# EasyEDA schematic TCRT5000-w-LDR.json
TITLE: Sheet_1; REV: 1.0; Date: 2024-02-27; Sheet: 1/1; Company: Your Company
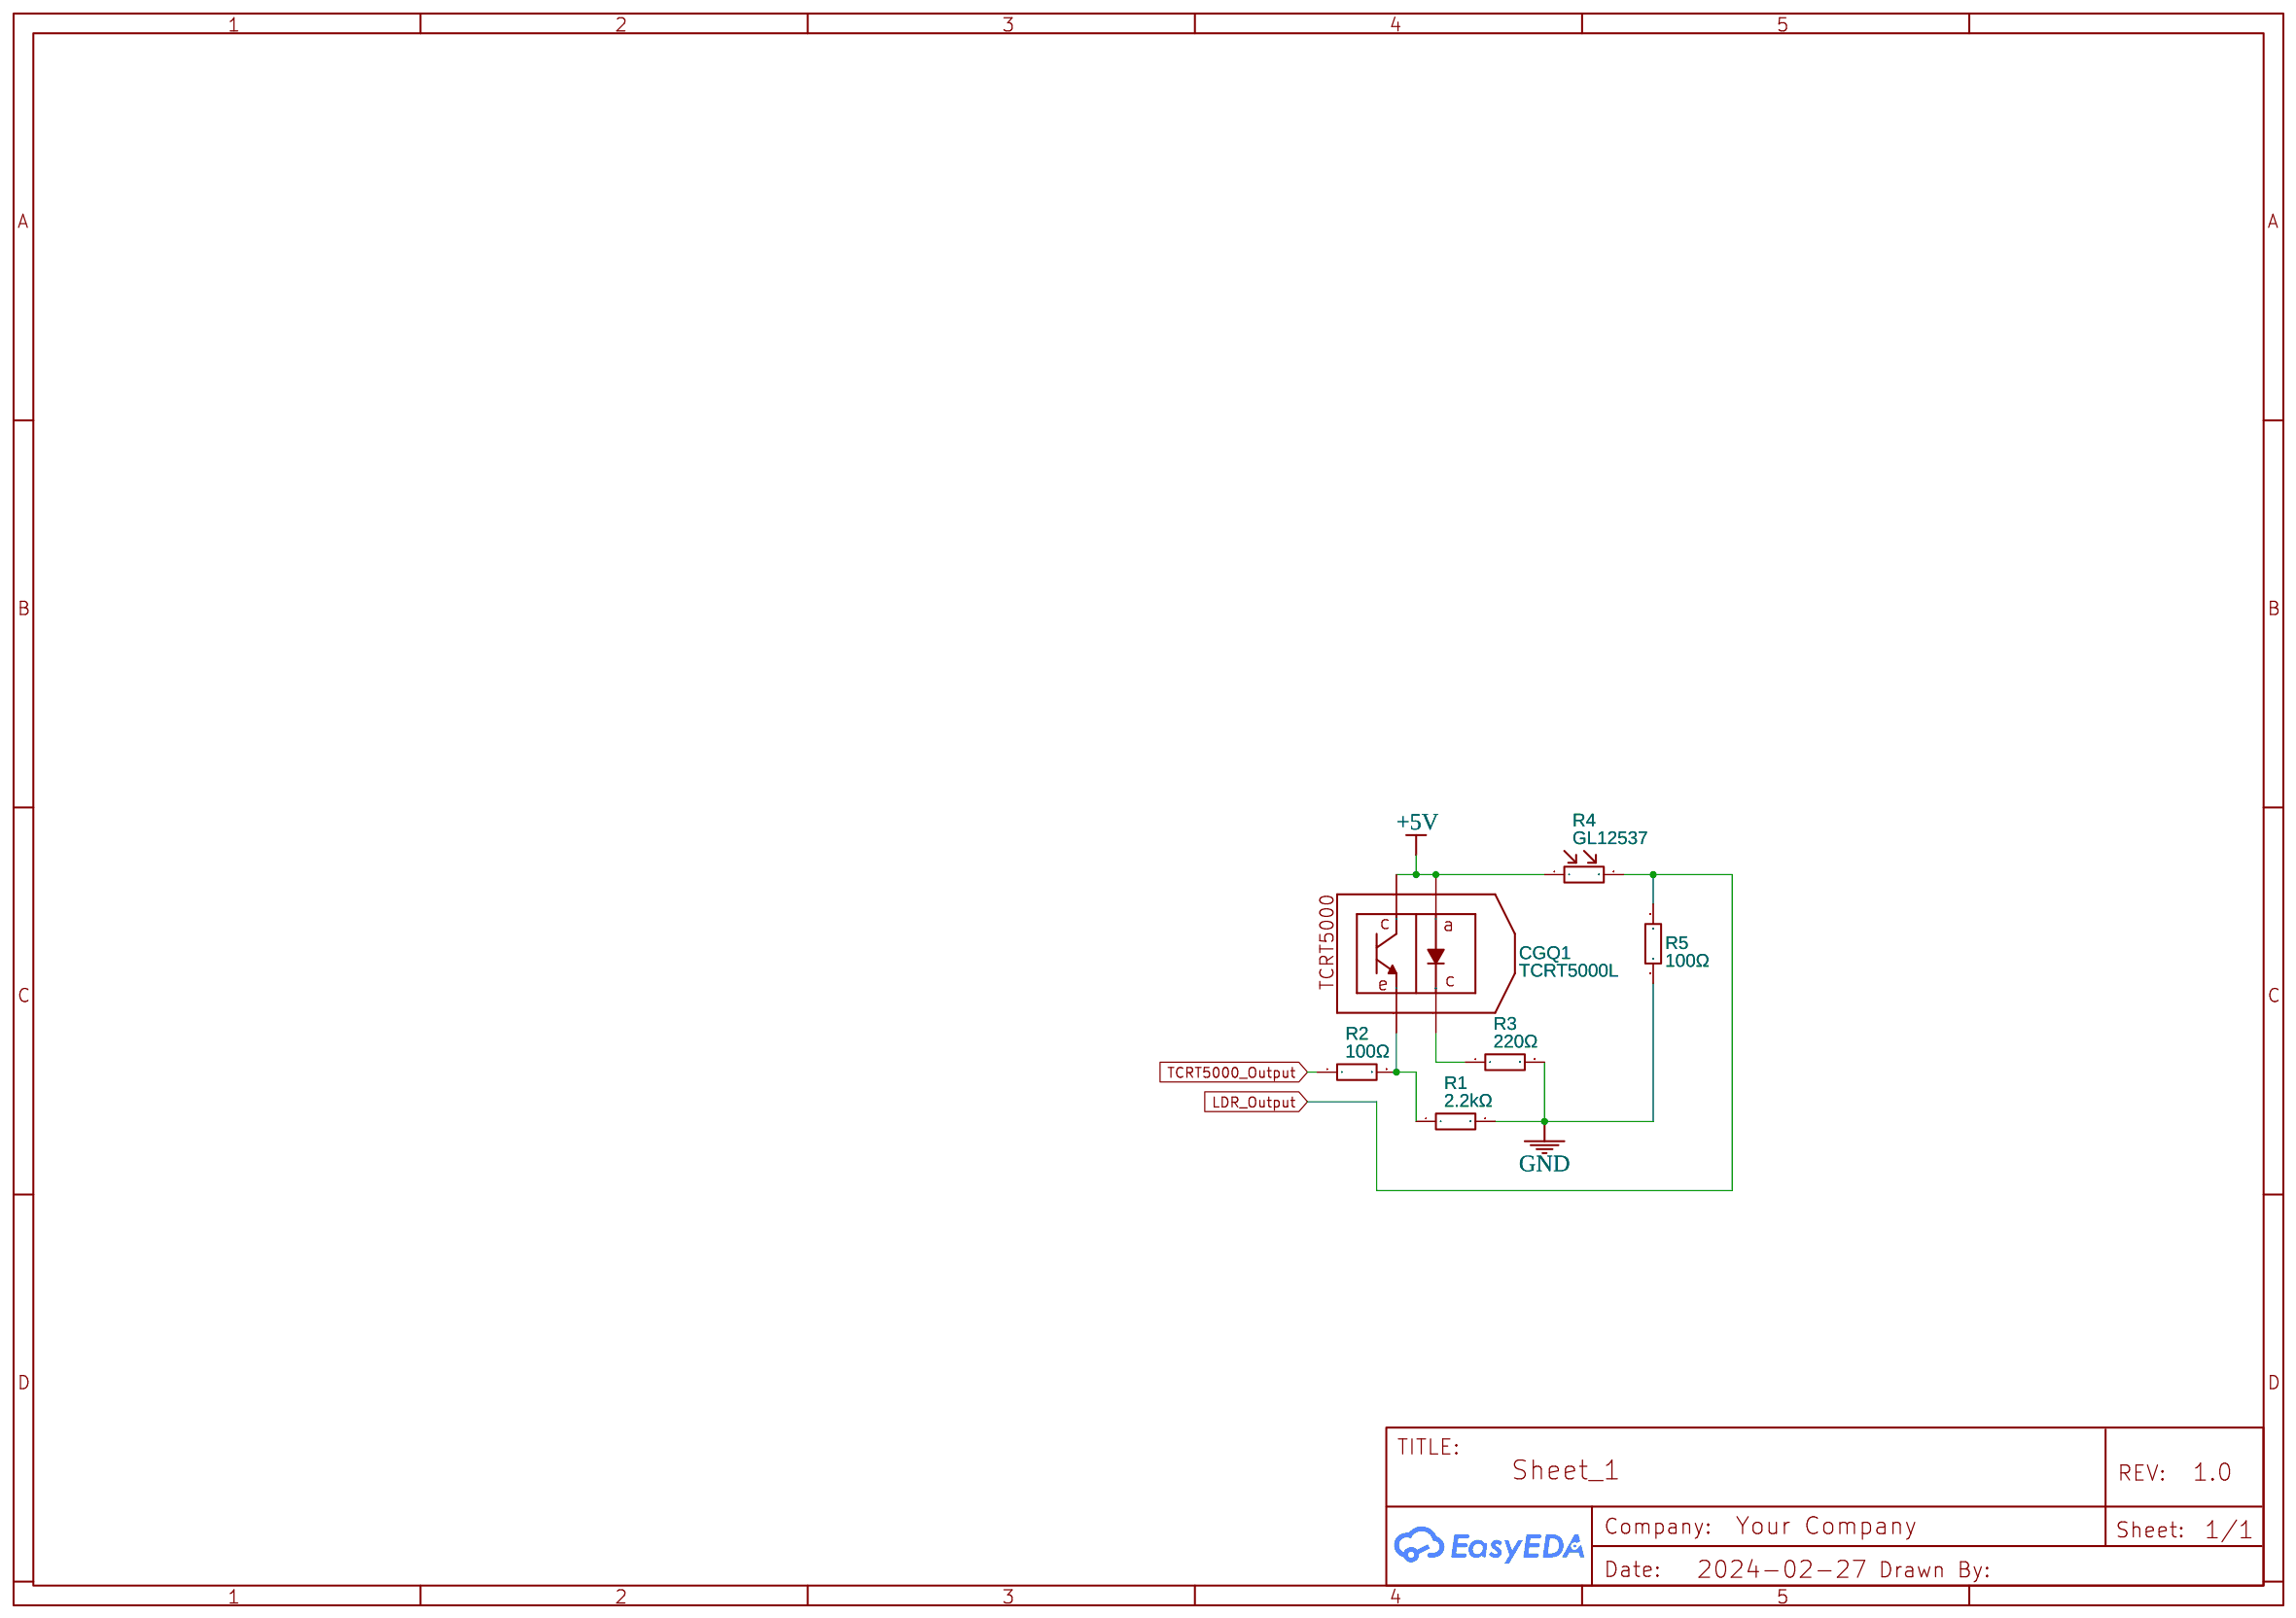
[diagram p0: schematic sheet]

## Parts
CGQ1  TCRT5000L  [OPTO-TH_TCRT5000L]
R1  2.2kΩ  [RES-TH_BD2.2-L6.5-P10.50-D0.6]
R2  100Ω  [RES-TH_BD2.3-L6.5-P10.50-D0.5]
R3  220Ω  [RES-TH_BD2.3-L6.5-P10.50-D0.5]
R4  GL12537  [RES-TH_L12.0-W10.5-P9.50-D0.6]
R5  100Ω  [RES-TH_BD2.3-L6.5-P10.50-D0.5]

## Library data of the parts
CGQ1 = TCRT5000L: Supplier: LCSC; Manufacturer: VISHAY(威世); Supplier Part: C24085; JLCPCB Part Class: Extended Part
R1 = CFR0W4J0222A50: Supplier: LCSC; Manufacturer: UNI-ROYAL(厚声); Supplier Part: C61295; JLCPCB Part Class: Extended Part
R2 = CF1/4W-100Ω±5% T52: Contributor: LCSC; Supplier: LCSC; Supplier Part: C120031; Manufacturer: CCO(千志电子); Manufacturer Part: CF1/4W-100Ω±5% T; JLCPCB Part Class: Extended Part
R3 = CF1/4W-220Ω±5% T52: Contributor: LCSC; Supplier: LCSC; Supplier Part: C120039; Manufacturer: CCO(千志电子); Manufacturer Part: CF1/4W-220Ω±5% T; JLCPCB Part Class: Extended Part
R4 = GL12537: Contributor: LCSC; Supplier: LCSC; Supplier Part: C559387; Manufacturer: JCHL(晶创和立); JLCPCB Part Class: Extended Part
R5 = CF1/4W-100Ω±5% T52: Contributor: LCSC; Supplier: LCSC; Supplier Part: C120031; Manufacturer: CCO(千志电子); Manufacturer Part: CF1/4W-100Ω±5% T; JLCPCB Part Class: Extended Part; link: https://lcsc.com/eda_search?q=C120031&%26type=1&ref=editor

## Nets
+5V: CGQ1.1(C) CGQ1.3(A) R4.1
GND: R1.2 R3.2 R5.1
LDR_Output: R4.2 R5.2
TCRT5000_Output: R2.1
Net-(CGQ1-2): CGQ1.2(E) R1.1 R2.2
Net-(CGQ1-4): CGQ1.4(C) R3.1
